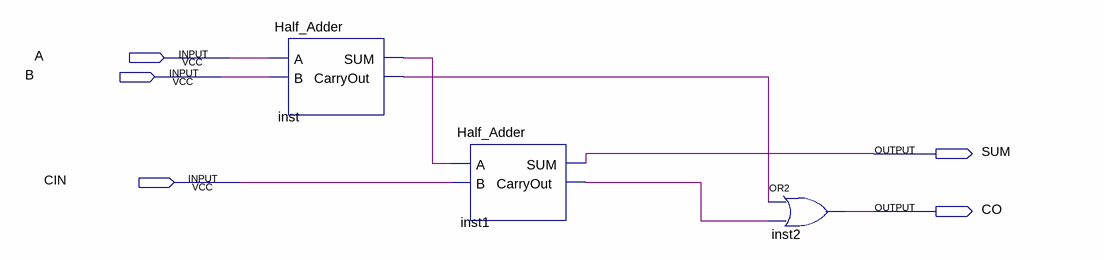
[diagram p0: schematic sheet]
// Quartus schematic Full_Adder1bit.bdf as structural Verilog: 3 symbols, 5 pins
module Full_Adder1bit (
  input  A,
  input  B,
  input  CIN,
  output SUM,
  output CO
);

  wire inst1_carryout, inst_carryout, inst_sum;

  Half_Adder inst (.A(A), .B(B), .SUM(inst_sum), .CarryOut(inst_carryout));
  Half_Adder inst1 (.A(inst_sum), .B(CIN), .SUM(SUM), .CarryOut(inst1_carryout));
  or inst2 (CO, inst_carryout, inst1_carryout);
endmodule
